# EAGLE design gps_tracker2.0 (EAGLE 9.6.2)
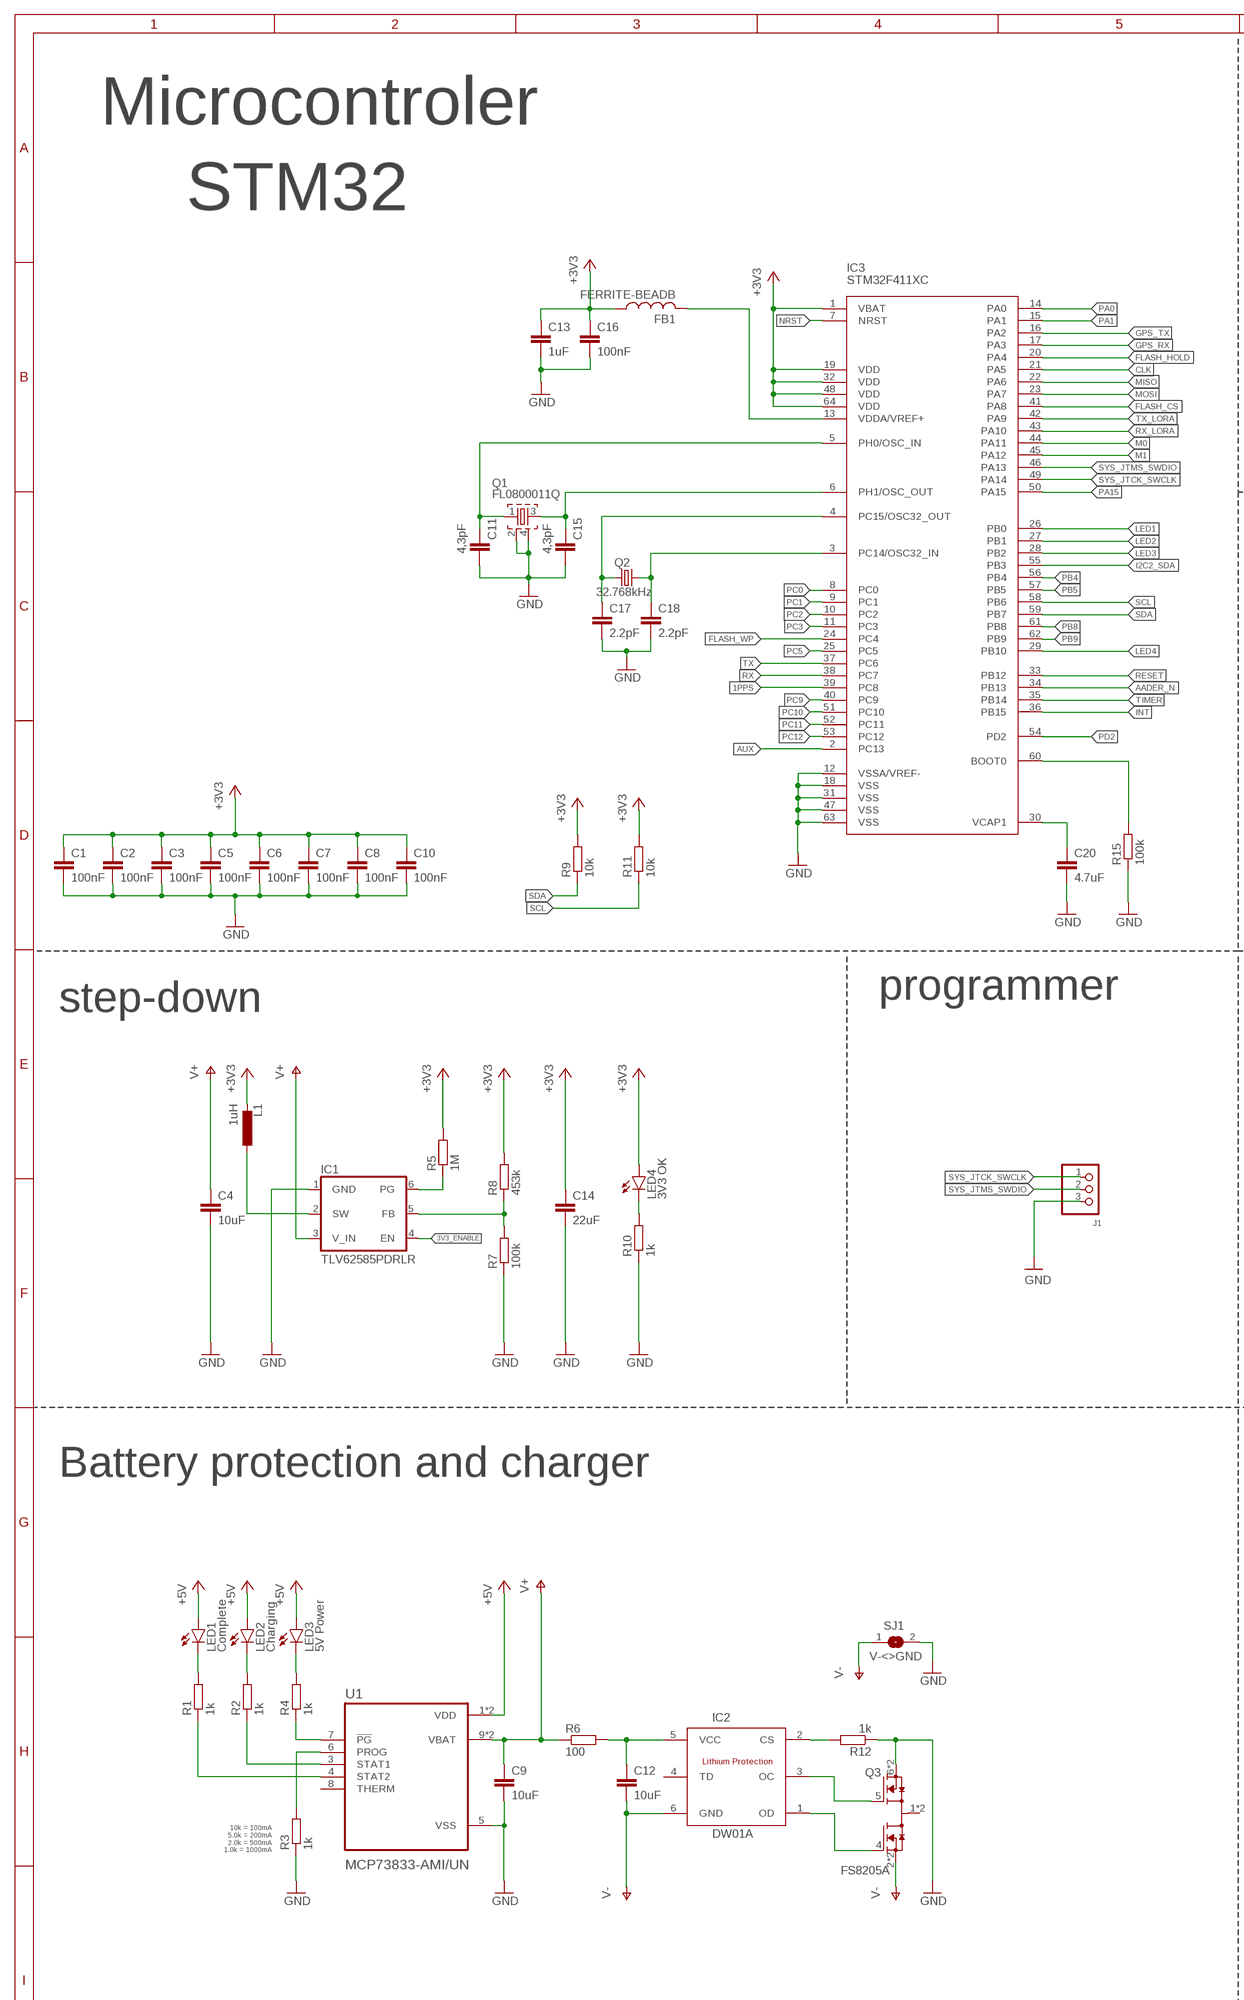
[diagram p0: schematic, sheet 1, part 1 of 2]
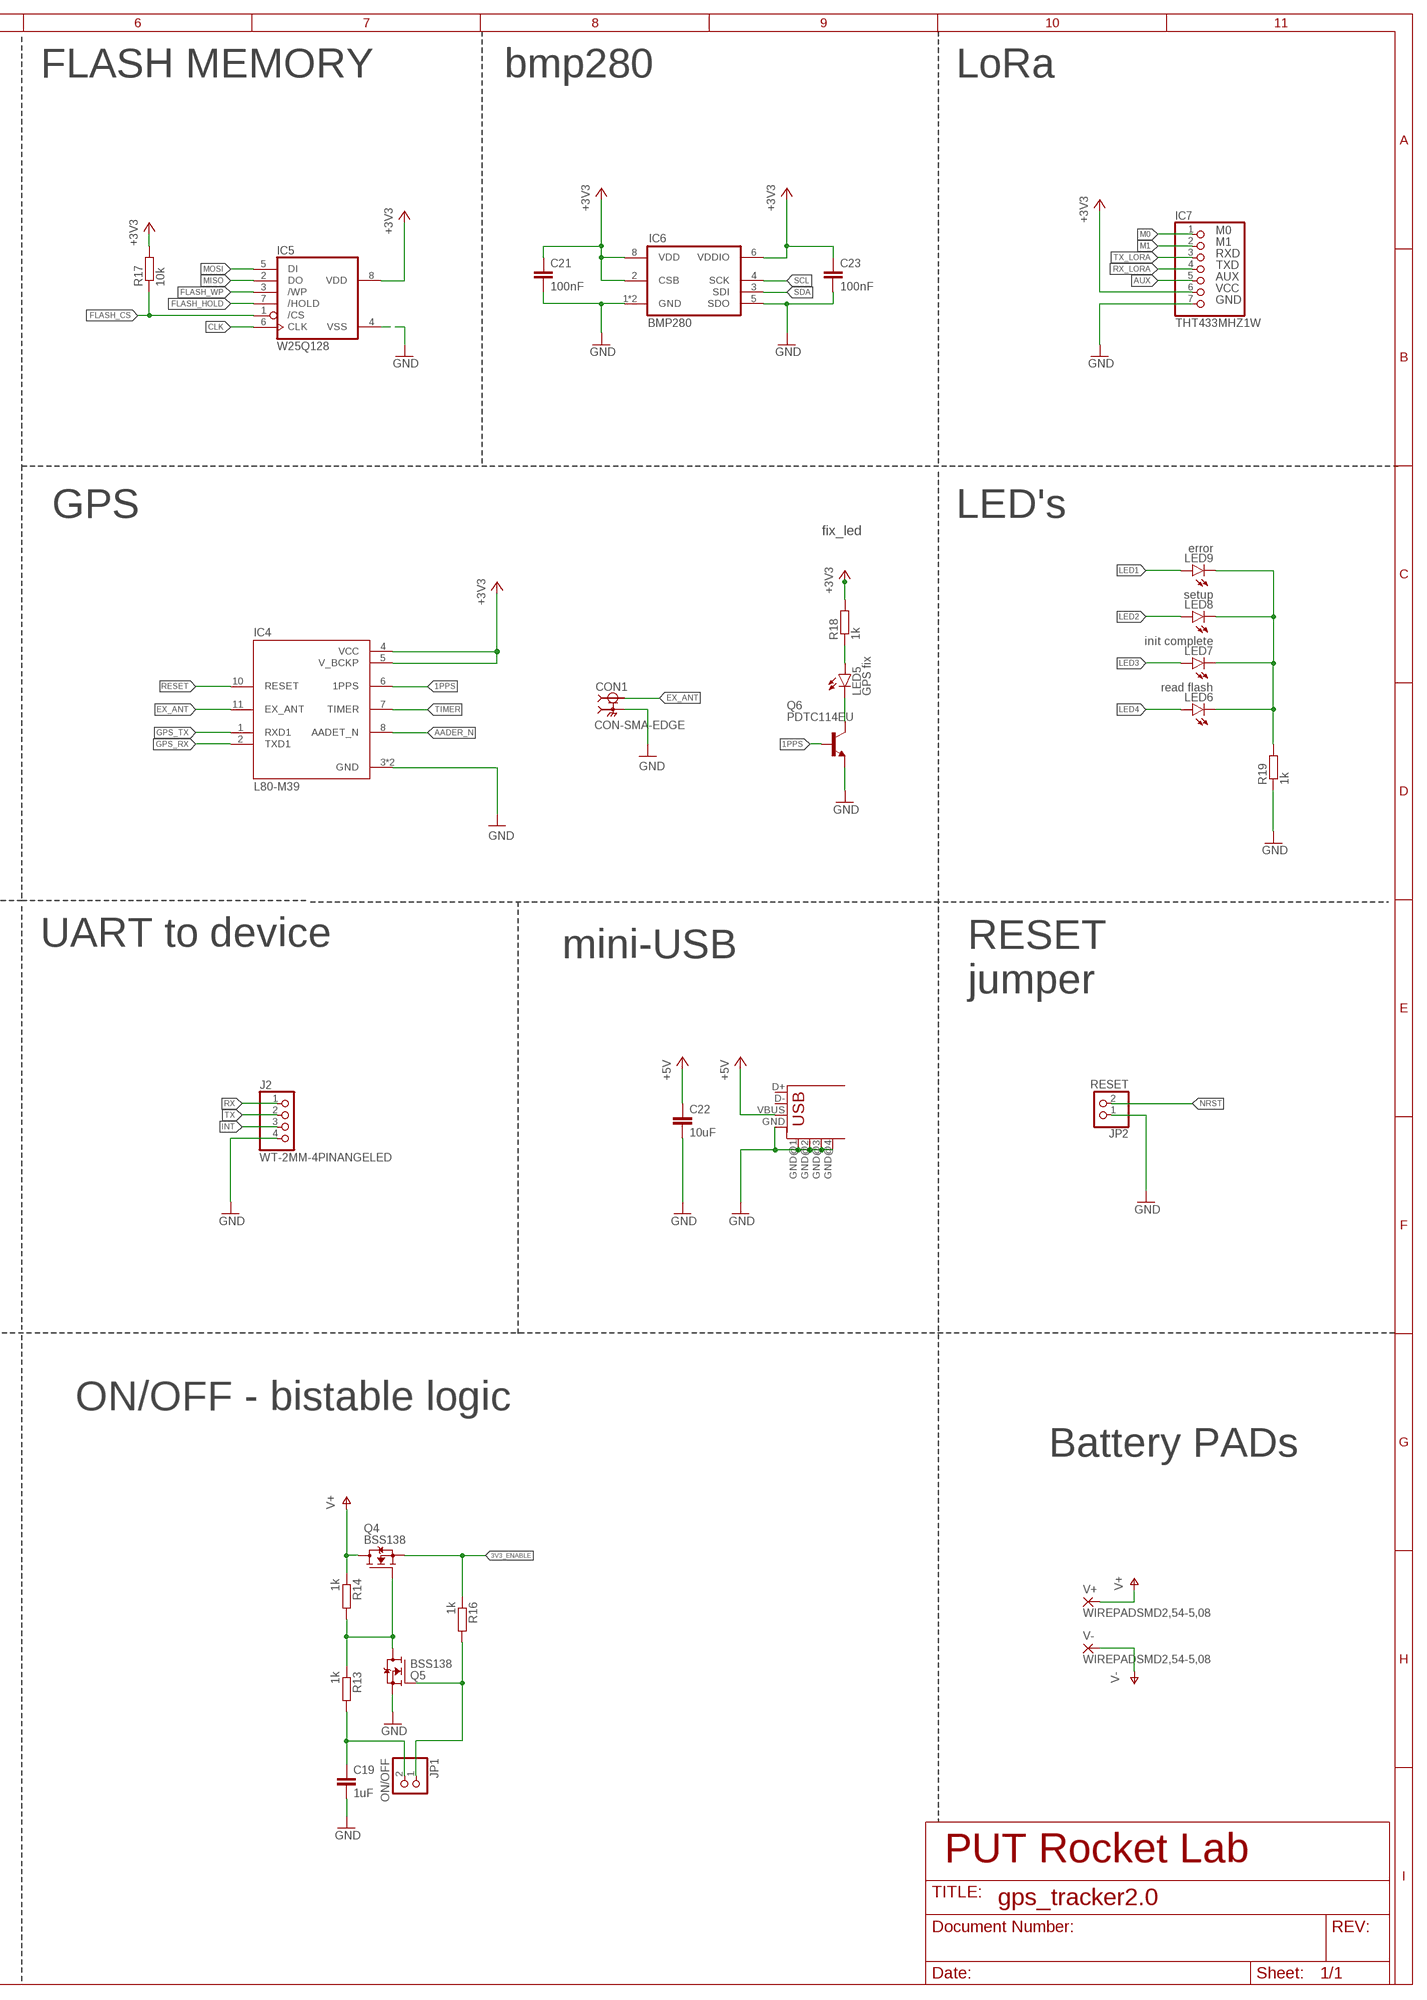
[diagram p1: schematic, sheet 1, part 2 of 2]

## Parts
C1  100nF  C-EUC0805  [C0805]
C2  100nF  C-EUC0805  [C0805]
C3  100nF  C-EUC0805  [C0805]
C4  10uF  C-EUC0805  [C0805]
C5  100nF  C-EUC0805  [C0805]
C6  100nF  C-EUC0805  [C0805]
C7  100nF  C-EUC0805  [C0805]
C8  100nF  C-EUC0805  [C0805]
C9  10uF  C-EUC0805  [C0805]
C10  100nF  C-EUC0805  [C0805]
C11  4,3pF  C-EUC0805  [C0805]
C12  10uF  C-EUC0805  [C0805]
C13  1uF  C-EUC0805  [C0805]
C14  22uF  C-EUC0805  [C0805]
C15  4,3pF  C-EUC0805  [C0805]
C16  100nF  C-EUC0805  [C0805]
C17  2.2pF  C-EUC0805  [C0805]
C18  2.2pF  C-EUC0805  [C0805]
C19  1uF  C-EUC0805  [C0805]
C20  4.7uF  C-EUC0805  [C0805]
C21  100nF  C-EUC0805  [C0805]
C22  10uF  C-EUC0805  [C0805]
C23  100nF  C-EUC0805  [C0805]
CON1  CON-SMA-EDGE  [CINCH_142-0701-801]
CON2  USB-SHIELD  [USB-M-S1]
FB1  FERRITE-BEADB  [0805]
IC1  TLV62585PDRLR  [SOT563]
IC2  DW01A  [SOT23-6]
IC3  STM32F411XC  [LQFP64]
IC4  L80-M39  [XCVR_L80-M39]
IC5  W25Q128  [SO08-FLASH]
IC6  BMP280  [BMP280]
IC7  THT433MHZ1W  [E32M1000]
J1  WT-2MM-3PINANGELED  [W_TYPE_2MM_3_A]
J2  WT-2MM-4PINANGELED  [W_TYPE_2MM_4_A]
JP1  ON/OFF  PINHD-1X2  [1X02]
JP2  RESET  PINHD-1X2  [1X02]
L1  1uH  L-EUL5650M  [L5650M]
LED1  Complete  LEDCHIPLED_0805  [CHIPLED_0805]
LED2  Charging  LEDCHIPLED_0805  [CHIPLED_0805]
LED3  5V Power  LEDCHIPLED_0805  [CHIPLED_0805]
LED4  3V3 OK  LEDCHIPLED_0805  [CHIPLED_0805]
LED5  GPS fix  LEDCHIPLED_0805  [CHIPLED_0805]
LED6  read flash  LEDCHIPLED_0805  [CHIPLED_0805]
LED7  init complete  LEDCHIPLED_0805  [CHIPLED_0805]
LED8  setup  LEDCHIPLED_0805  [CHIPLED_0805]
LED9  error  LEDCHIPLED_0805  [CHIPLED_0805]
Q1  FL0800011Q  [FL0800011Q]
Q2  32.768kHz  FC-135_32.768  [MC-405]
Q3  FS8205A  [SOP65P640X120-8N]
Q4  BSS138  [SOT23]
Q5  BSS138  [SOT23]
Q6  PDTC114EU  BC846ASMD  [SOT23]
R1  1k  R-EU_R0805  [R0805]
R2  1k  R-EU_R0805  [R0805]
R3  1k  R-EU_R0805  [R0805]
R4  1k  R-EU_R0805  [R0805]
R5  1M  R-EU_R0805  [R0805]
R6  100  R-EU_R0805  [R0805]
R7  100k  R-EU_R0805  [R0805]
R8  453k  R-EU_R0805  [R0805]
R9  10k  R-EU_R0805  [R0805]
R10  1k  R-EU_R0805  [R0805]
R11  10k  R-EU_R0805  [R0805]
R12  1k  R-EU_R0805  [R0805]
R13  1k  R-EU_R0805  [R0805]
R14  1k  R-EU_R0805  [R0805]
R15  100k  R-EU_R0805  [R0805]
R16  1k  R-EU_R0805  [R0805]
R17  10k  R-EU_R0805  [R0805]
R18  1k  R-EU_R0805  [R0805]
R19  1k  R-EU_R0805  [R0805]
SJ1  V-<>GND  SJ  [SJ]
U1  MCP73833-AMI/UN  [SOP50P490X110-10N]
V+  WIREPADSMD2,54-5,08  [SMD2,54-5,08]
V-  WIREPADSMD2,54-5,08  [SMD2,54-5,08]

## Nets
1PPS: IC3.39(PC8) IC4.6(1PPS) Q6.1(B)
3V3_ENABLE: IC1.4(EN) Q4.2(S) R16.1
+3V3: C1.1 C2.1 C3.1 C5.1 C6.1 C7.1 C8.1 C10.1 C13.1 C14.1 C16.1 C21.1 C23.1 FB1.1 IC3.1(VBAT) IC3.19(VDD) IC3.32(VDD) IC3.48(VDD) IC3.64(VDD) IC4.4(VCC) IC4.5(V_BCKP) IC5.8(VDD) IC6.2(CSB) IC6.6(VDDIO) IC6.8(VDD) IC7.6(VCC) L1.2 LED4.A R5.2 R8.2 R9.2 R11.2 R17.2 R18.2
+5V: C22.1 CON2.VBUS LED1.A LED2.A LED3.A U1.1(VDD) U1.2(VDD)
AADER_N: IC3.34(PB13) IC4.8(AADET_N)
AUX: IC3.2(PC13) IC7.5(AUX)
CLK: IC3.21(PA5) IC5.6(CLK)
EX_ANT: CON1.1 IC4.11(EX_ANT)
FLASH_CS: IC3.41(PA8) IC5.1(/CS) R17.1
FLASH_HOLD: IC3.20(PA4) IC5.7(/HOLD)
FLASH_WP: IC3.24(PC4) IC5.3(/WP)
GND: C1.2 C2.2 C3.2 C4.2 C5.2 C6.2 C7.2 C8.2 C9.2 C10.2 C11.2 C13.2 C14.2 C15.2 C16.2 C17.2 C18.2 C19.2 C20.2 C21.2 C22.2 C23.2 CON1.S1 CON1.S2 CON1.S3 CON1.S4 CON2.GND CON2.GND@1(GND) CON2.GND@2(GND) CON2.GND@3(GND) CON2.GND@4(GND) IC1.1(GND) IC3.12(VSSA/VREF-) IC3.18(VSS) IC3.31(VSS) IC3.47(VSS) IC3.63(VSS) IC4.3(GND) IC4.12(GND) IC5.4(VSS) IC6.1(GND) IC6.5(SDO) IC6.7(GND) IC7.7(GND) J1.3 J2.4 JP2.1 Q1.2 Q1.4 Q3.6(S2) Q3.7(S2) Q5.2(S) Q6.2(E) R3.1 R7.1 R10.1 R12.1 R15.1 R19.1 SJ1.2 U1.5(VSS)
GPS_RX: IC3.17(PA3) IC4.2(TXD1)
GPS_TX: IC3.16(PA2) IC4.1(RXD1)
I2C2_SDA: IC3.55(PB3)
INT: IC3.36(PB15) J2.3
LED1: IC3.26(PB0) LED9.A
LED2: IC3.27(PB1) LED8.A
LED3: IC3.28(PB2) LED7.A
LED4: IC3.29(PB10) LED6.A
M0: IC3.44(PA11) IC7.1(M0)
M1: IC3.45(PA12) IC7.2(M1)
MISO: IC3.22(PA6) IC5.2(DO)
MOSI: IC3.23(PA7) IC5.5(DI)
N$1: LED6.C LED7.C LED8.C LED9.C R19.2
N$2: LED3.C R4.2
N$3: R4.1 U1.7(!PG)
N$4: R2.1 U1.3(STAT1)
N$5: LED2.C R2.2
N$6: R1.1 U1.4(STAT2)
N$7: LED1.C R1.2
N$8: R3.2 U1.6(PROG)
N$9: C12.1 IC2.5(VCC) R6.2
N$10: IC2.3(OC) Q3.5(G2)
N$11: IC2.1(OD) Q3.4(G1)
N$12: IC2.2(CS) R12.2
N$13: Q4.1(G) Q5.3(D) R13.1 R14.2
N$14: C19.1 JP1.2 R13.2
N$16: JP1.1 Q5.1(G) R16.2
N$21: LED4.C R10.2
N$24: IC1.5(FB) R7.2 R8.1
N$25: IC1.6(PG) R5.1
N$26: IC1.2(SW) L1.1
N$33: C20.1 IC3.30(VCAP1)
N$34: C18.1 IC3.3(PC14/OSC32_IN) Q2.2
N$35: C17.1 IC3.4(PC15/OSC32_OUT) Q2.1
N$36: C15.1 IC3.6(PH1/OSC_OUT) Q1.3
N$38: IC3.60(BOOT0) R15.2
N$39: FB1.2 IC3.13(VDDA/VREF+)
N$46: C11.1 IC3.5(PH0/OSC_IN) Q1.1
N$49: LED5.C Q6.3(C)
N$50: LED5.A R18.1
NRST: IC3.7(NRST) JP2.2
PA0: IC3.14(PA0)
PA1: IC3.15(PA1)
PA15: IC3.50(PA15)
PB4: IC3.56(PB4)
PB5: IC3.57(PB5)
PB8: IC3.61(PB8)
PB9: IC3.62(PB9)
PC0: IC3.8(PC0)
PC1: IC3.9(PC1)
PC2: IC3.10(PC2)
PC3: IC3.11(PC3)
PC5: IC3.25(PC5)
PC9: IC3.40(PC9)
PC10: IC3.51(PC10)
PC11: IC3.52(PC11)
PC12: IC3.53(PC12)
PD2: IC3.54(PD2)
RESET: IC3.33(PB12) IC4.10(RESET)
RX: IC3.38(PC7) J2.1
RX_LORA: IC3.43(PA10) IC7.4(TXD)
SCL: IC3.58(PB6) IC6.4(SCK) R11.1
SDA: IC3.59(PB7) IC6.3(SDI) R9.1
SYS_JTCK_SWCLK: IC3.49(PA14) J1.1
SYS_JTMS_SWDIO: IC3.46(PA13) J1.2
TIMER: IC3.35(PB14) IC4.7(TIMER)
TX: IC3.37(PC6) J2.2
TX_LORA: IC3.42(PA9) IC7.3(RXD)
V+: C4.1 C9.1 IC1.3(V_IN) Q4.3(D) R6.1 R14.1 U1.9(VBAT) U1.10(VBAT) V+.1(P)
V-: C12.2 IC2.6(GND) Q3.2(S1) Q3.3(S1) SJ1.1 V-.1(P)
Unconnected: CON2.D+ CON2.D- IC2.4(TD) Q3.1(D12) Q3.8(D12) U1.8(THERM)

## Notes on the sheet
- FLASH MEMORY | bmp280 | LoRa
- Microcontroler
- STM32
- GPS | LED's
- fix_led
- step-down | programmer | UART to device | mini-USB
- RESET 
  jumper
- Battery protection and charger | ON/OFF - bistable logic
- Battery PADs
- 10k = 100mA
  5.0k = 200mA
  2.0k = 500mA
  1.0k = 1000mA
- PUT Rocket Lab

## Library data of the parts
C1-C23 = PUTRocketLab_RCL:C-EU: CAPACITOR, European symbol; SPICEPREFIX: C
CON1 = PUTRocketLab_connectors:CON-SMA-EDGE: Conn SMA RCP 0Hz to 18GHz 50Ohm Solder ST Edge Mount Gold Check prices <https://snapeda.com/parts/142-0701-801/Cinch%20Connectivity/view-part/?ref=eda>; AVAILABILITY: Warning; DESCRIPTION: SMA Connector Jack, Female Socket 50Ohm Board Edge, End Launch Solder; DIGIKEY-PURCHASE-URL: https://snapeda.com/shop?store=DigiKey&id=2691213; MF: Cinch Connectivity; MOUSER-PURCHASE-URL: https://snapeda.com/shop?store=Mouser&id=2691213; MP: 142-0701-801; PACKAGE: None; PRICE: None
CON2 = PUTRocketLab_connectors:USB-SHIELD
FB1 = PUTRocketLab_RCL:FERRITE-BEAD: Ferrite beads in various packages
IC1 = PUTRocketLab_IC:TLV62585PDRLR
IC2 = PUTRocketLab_IC:DW01A; AVAILABILITY: Unavailable; DESCRIPTION: One Cell Lithium-ion/Polymer Battery Protection IC; MF: Fortune Semiconductor; MP: DW01A; PACKAGE: SOT-23-6 Fortune Semiconductor; PRICE: None
IC3 = PUTRocketLab_IC:STM32F411XC
IC4 = PUTRocketLab_modules:L80-M39: Check prices <https://pricing.snapeda.com/search/part/L80-M39/?ref=eda>; AVAILABILITY: Bad; DESCRIPTION: L80 is an ultra compact GPS POT (Patch on Top) module with an embedded 15.0mm × 15.0mm × 4.0mm patch antenna.; MF: Quectel; MP: L80-M39; PACKAGE: None; PRICE: None
IC5 = PUTRocketLab_IC:W25Q128
IC6 = PUTRocketLab_modules:BMP280: The BMP280 is an absolute barometric pressure sensor especially designed for mobile applications. The sensor module is housed in an extremely compact 8-pin metal-lid LGA package with a footprint of only 2.0 × 2.5 mm2 and 0.95 mm package height. Its small dimensions and its low power consumption of 2.7 μA @1Hz allow the implementation in battery driven devices such as mobile phones, GPS modules or watches. The library has been designed by Richard Magdycz <https://www.facebook.com/groups/eaglecadsoftUK>
IC7 = PUTRocketLab_modules:THT433MHZ1W
J1 = PUTRocketLab_connectors:WT-2MM-3PIN
J2 = PUTRocketLab_connectors:WT-2MM-4PIN
JP1 JP2 = PUTRocketLab_connectors:PINHD-1X2: PIN HEADER
L1 = PUTRocketLab_RCL:L-EU: INDUCTOR, European symbol; SPICEPREFIX: L
LED1-LED9 = PUTRocketLab_semiconductors:LED: LED OSRAM: - CHIPLED LG R971, LG N971, LY N971, LG Q971, LY Q971, LO R971, LY R971 LH N974, LH R974 LS Q976, LO Q976, LY Q976 LO Q996 - Hyper CHIPLED LW Q18S LB Q993, LB Q99A, LB R99A - SideLED LS A670, LO A670, LY A670, LG A670, LP A670 LB A673, LV A673, LT A673, LW A673 LH A674 LY A675 LS A676, LA A676, LO A676, LY A676, LW A676 LS A679, LY A679, LG A679 - Hyper Micro SIDELED® LS Y876, LA Y876, LO Y876, LY Y876 LT Y87S - SmartLED LW L88C, LW L88S LB L89C, LB L89S, LG L890 LS L89K, LO L89K, LY L89K LS L896, LA L896, LO L896, LY L896 - TOPLED LS T670, LO T670, LY T670, LG T670, LP T670 LSG T670, LSP T670, LSY T670, LOP T670, LYG T670 LG T671, LOG T671, LSG T671 LB T673, LV T673, LT T673, LW T673 LH T674 LS T676, LA T676, LO T676, LY T676, LB T676, LH T676, LSB T676, LW T676 LB T67C, LV T67C, LT T67C, LS T67K, LO T67K, LY T67K, LW E67C LS E67B, LA E67B, LO E67B, LY E67B, LB E67C, LV E67C, LT E67C LW T67C LS T679, LY T679, LG T679 LS T770, LO T770, LY T770, LG T770, LP T770 LB T773, LV T773, LT T773, LW T773 LH T774 LS E675, LA E675, LY E675, LS T675 LS T776, LA T776, LO T776, LY T776, LB T776 LHGB T686 LT T68C, LB T68C - Hyper Mini TOPLED® LB M676 - Mini TOPLED Santana® LG M470 LS M47K, LO M47K, LY M47K Source: http://www.osram.convergy.de LUXEON: - LUMILED® LXK2-PW12-R00, LXK2-PW12-S00, LXK2-PW14-U00, LXK2-PW14-V00 LXK2-PM12-R00, LXK2-PM12-S00, LXK2-PM14-U00 LXK2-PE12-Q00, LXK2-PE12-R00, LXK2-PE12-S00, LXK2-PE14-T00, LXK2-PE14-U00 LXK2-PB12-K00, LXK2-PB12-L00, LXK2-PB12-M00, LXK2-PB14-N00, LXK2-PB14-P00, LXK2-PB14-Q00 LXK2-PR12-L00, LXK2-PR12-M00, LXK2-PR14-Q00, LXK2-PR14-R00 LXK2-PD12-Q00, LXK2-PD12-R00, LXK2-PD12-S00 LXK2-PH12-R00, LXK2-PH12-S00 LXK2-PL12-P00, LXK2-PL12-Q00, LXK2-PL12-R00 Source: www.luxeon.com KINGBRIGHT: KA-3528ASYC Source: www.kingbright.com
Q1 = PUTRocketLab_cristals:FL0800011Q: kHz RANGE CRYSTAL UNIT SMD Source: MC-306_405_406_E07X.PDF Homepage <http://www.epsontoyocom.co.jp>
Q2 = PUTRocketLab_cristals:FC-135_32.768: kHz RANGE CRYSTAL UNIT SMD Source: MC-306_405_406_E07X.PDF Homepage <http://www.epsontoyocom.co.jp>; OC_FARNELL: unknown; OC_NEWARK: unknown
Q3 = PUTRocketLab_IC:FS8205A: N/A; AVAILABILITY: Unavailable; MF: Fortune Semiconductor; MP: FS8205A; PACKAGE: Package; PRICE: None
Q4 Q5 = PUTRocketLab_semiconductors:BSS138: BSS138 N-Channel Logic Level Enhancement Mode Field Effect Transistor Source: http://www.fairchildsemi.com/datasheets/BS/BSS138.pdf; MF: Fairchild; MPN: BSS138; OC_FARNELL: 9845330; OC_NEWARK: 67R2009
Q6 = PUTRocketLab_semiconductors:BC846*: NPN Transistor
R1-R19 = PUTRocketLab_RCL:R-EU_: RESISTOR, European symbol; SPICEPREFIX: R
SJ1 = PUTRocketLab_misc:SJ: SMD solder JUMPER
U1 = PUTRocketLab_IC:MCP73833-AMI/UN: Check prices <https://snapeda.com/parts/MCP73833-AMI/UN/Microchip/view-part/?ref=eda>; ARROW_ELECTRONICS-PURCHASE-URL: https://snapeda.com/shop?store=Arrow+Electronics&id=142622; AVAILABILITY: Good; DESCRIPTION: Charger IC Lithium Ion/Polymer 10-MSOP; DIGIKEY-PURCHASE-URL: https://snapeda.com/shop?store=DigiKey&id=142622; MF: Microchip; MOUSER-PURCHASE-URL: https://snapeda.com/shop?store=Mouser&id=142622; MP: MCP73833-AMI/UN; PACKAGE: MSOP-10 Microchip; PRICE: None
V+ V- = PUTRocketLab_misc:WIREPAD: Wire PAD connect wire on PCB

## Board
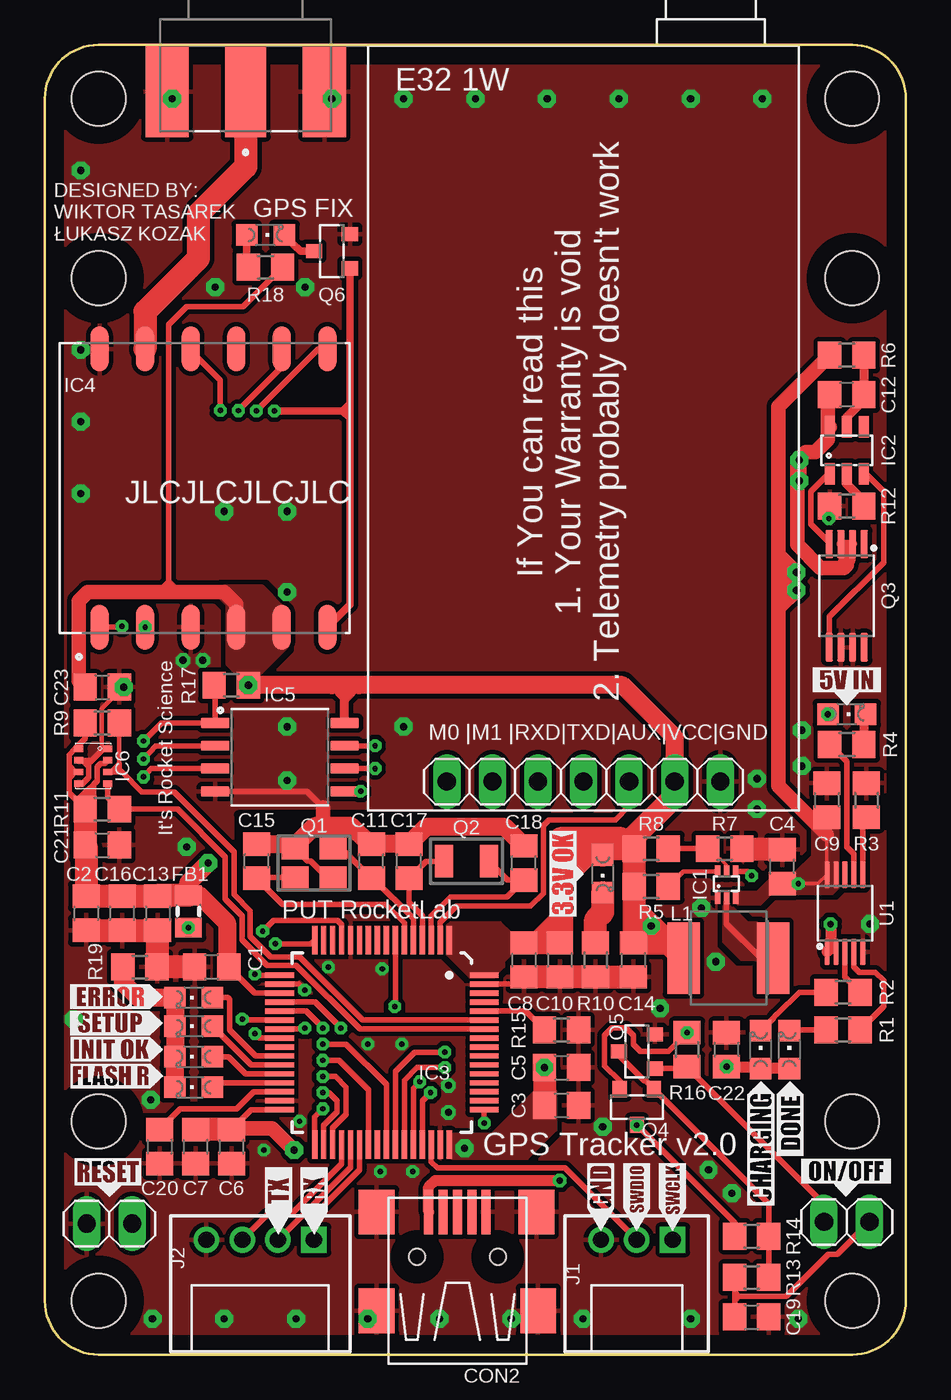
[diagram p2: board, top side]
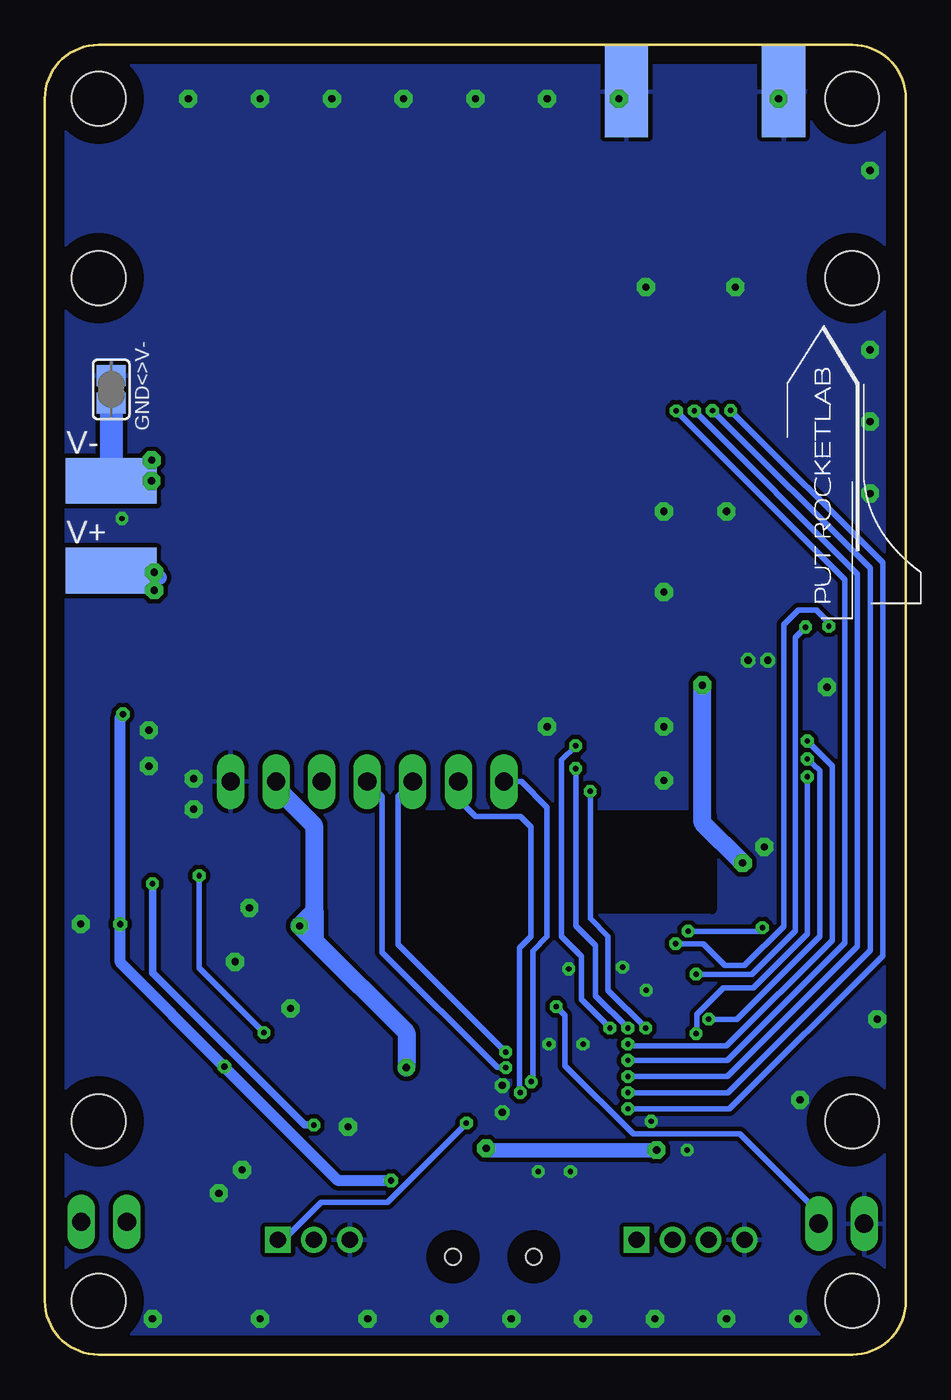
[diagram p3: board, bottom side, seen from below]

Size 48 x 73 mm. Coordinates in mm from the lower left corner, seen from the top.
Outline: 45,0 3,0 arc-90 0,3 0,70 arc-90 3,73 45,73 arc-90 48,70 48,3 arc-90 45,0
Copper layers (1*16): Top 0.035mm / dielectric 1.5mm / Bottom 0.035mm
Design rules "default *": minimum track width 6mil, minimum drill 0.3mm, track to track 6mil, track to pad 6mil, pad to pad 6mil, via to via 6mil, smd to smd 6mil, copper to edge 40mil, drill to drill 6mil, minimum pad ring 10mil, minimum via ring 8mil, stop-mask expansion 4mil, vias tented up to drill 20mil, thermal gap 10mil
Holes 3 mm at 3,13 3,3 3,70 45,70 45,3 45,13 3,60 45,60
tRestrict: area 10.8,24.8 to 28,30.1
bRestrict: area 10.8,24.8 to 28,30.1

### Footprints (pad centres in the part's own frame; a part is rotated, then mirrored left to right if it is on the bottom)
C0805 = smd 1.3 x 1.5: 1 -0.95,0; 2 0.95,0
CINCH_142-0701-801 = smd 2.286 x 5.08: 1 0,0 | smd 2.413 x 5.08: S1 -4.381,0; S2 4.381,0 | smd 2.413 x 5.08 bottom: S3 -4.381,0; S4 4.381,0
USB-M-S1 = smd 2.5 x 0.5: D+ 2.75,0; D- 2.75,0.8; GND 2.75,-1.6; ID 2.75,-0.8; VBUS 2.75,1.6 | smd 2.5 x 2: GND@1 -2.75,-4.5; GND@2 -2.75,4.5; GND@3 2.75,-4.4; GND@4 2.75,4.5 | hole 0.9: 0.25,2.25; 0.25,-2.25
0805 = smd 1.1 x 1.5: 1 -0.9,0; 2 0.9,0
SOT563 = smd 0.3 x 0.67: 1 -0.5,-0.74; 2 0,-0.74; 3 0.5,-0.74; 4 0.5,0.74; 5 0,0.74; 6 -0.5,0.74
SOT23-6 = smd 0.55 x 1.2: 1 -0.95,-1.3; 2 0,-1.3; 3 0.95,-1.3; 4 0.95,1.3; 5 0,1.3; 6 -0.95,1.3
LQFP64 = smd 0.3 x 1.6: 1 -3.75,-5.7; 2 -3.25,-5.7; 3 -2.75,-5.7; 4 -2.25,-5.7; 5 -1.75,-5.7; 6 -1.25,-5.7; 7 -0.75,-5.7; 8 -0.25,-5.7; 9 0.25,-5.7; 10 0.75,-5.7; 11 1.25,-5.7; 12 1.75,-5.7; 13 2.25,-5.7; 14 2.75,-5.7; 15 3.25,-5.7; 16 3.75,-5.7; 33 3.75,5.7; 34 3.25,5.7; 35 2.75,5.7; 36 2.25,5.7; 37 1.75,5.7; 38 1.25,5.7; 39 0.75,5.7; 40 0.25,5.7; 41 -0.25,5.7; 42 -0.75,5.7; 43 -1.25,5.7; 44 -1.75,5.7; 45 -2.25,5.7; 46 -2.75,5.7; 47 -3.25,5.7; 48 -3.75,5.7 | smd 1.6 x 0.3: 17 5.7,-3.75; 18 5.7,-3.25; 19 5.7,-2.75; 20 5.7,-2.25; 21 5.7,-1.75; 22 5.7,-1.25; 23 5.7,-0.75; 24 5.7,-0.25; 25 5.7,0.25; 26 5.7,0.75; 27 5.7,1.25; 28 5.7,1.75; 29 5.7,2.25; 30 5.7,2.75; 31 5.7,3.25; 32 5.7,3.75; 49 -5.7,3.75; 50 -5.7,3.25; 51 -5.7,2.75; 52 -5.7,2.25; 53 -5.7,1.75; 54 -5.7,1.25; 55 -5.7,0.75; 56 -5.7,0.25; 57 -5.7,-0.25; 58 -5.7,-0.75; 59 -5.7,-1.25; 60 -5.7,-1.75; 61 -5.7,-2.25; 62 -5.7,-2.75; 63 -5.7,-3.25; 64 -5.7,-3.75
XCVR_L80-M39 = smd 2.5 x 1: 1 -7.75,6.35; 2 -7.75,3.81; 3 -7.75,1.27; 4 -7.75,-1.27; 5 -7.75,-3.81; 6 -7.75,-6.35; 7 7.75,-6.35; 8 7.75,-3.81; 9 7.75,-1.27; 10 7.75,1.27; 11 7.75,3.81; 12 7.75,6.35
SO08-FLASH = smd 0.58 x 1.61: 1 -1.905,-3.605; 2 -0.635,-3.605; 3 0.635,-3.605; 4 1.905,-3.605; 5 1.905,3.605; 6 0.635,3.605; 7 -0.635,3.605; 8 -1.905,3.605
BMP280 = smd 0.35 x 0.5: 1 0.975,-0.8; 2 0.325,-0.8; 3 -0.325,-0.8; 4 -0.975,-0.8; 5 -0.975,0.8; 6 -0.325,0.8; 7 0.325,0.8; 8 0.975,0.8
E32M1000 = drill 1.016 long: 1 -7.62,0; 2 -5.08,0; 3 -2.54,0; 4 0,0; 5 2.54,0; 6 5.08,0; 7 7.62,0
W_TYPE_2MM_3_A = drill 0.914 square: 1 -2,0 | drill 0.914: 2 0,0; 3 2,0
W_TYPE_2MM_4_A = drill 0.914 square: 1 -3,0 | drill 0.914: 2 -1,0; 3 1,0; 4 3,0
1X02 = drill 1.016 long: 1 -1.27,0; 2 1.27,0
L5650M = smd 1.8 x 4: 1 -2.5,0; 2 2.5,0
CHIPLED_0805 = smd 1.2 x 1.2: A 0,-1.05; C 0,1.05
FL0800011Q = smd 1.5 x 1.2: 1 -1.06,-0.8; 2 1.06,-0.8; 3 1.06,0.8; 4 -1.06,0.8
MC-405 = smd 1 x 1.8: 1 -1.25,0; 2 1.25,0
SOP65P640X120-8N = smd 1.56 x 0.4: 1 -2.88,0.975; 2 -2.88,0.325; 3 -2.88,-0.325; 4 -2.88,-0.975; 5 2.88,-0.975; 6 2.88,-0.325; 7 2.88,0.325; 8 2.88,0.975
SOT23 = smd 0.8 x 0.9: 1 -0.95,-1; 2 0.95,-1; 3 0,1
R0805 = smd 1.3 x 1.5: 1 -0.95,0; 2 0.95,0
SJ = smd 1.168 x 1.6: 1 -0.762,0; 2 0.762,0
SOP50P490X110-10N = smd 1.47 x 0.28: 1 -2.15,1; 2 -2.15,0.5; 3 -2.15,0; 4 -2.15,-0.5; 5 -2.15,-1; 6 2.15,-1; 7 2.15,-0.5; 8 2.15,0; 9 2.15,0.5; 10 2.15,1
SMD2,54-5,08 = smd 2.54 x 5.08: 1 0,0

### Placement (x,y rotation side)
C1  9.3,21.6 180 top
C2  2.3,24.6 270 top
C3  28.8,13.9 0 top
C4  41.1,27.2 90 top
C5  28.8,16 0 top
C6  10.4,11.6 270 top
C7  8.4,11.6 270 top
C8  26.7,22 270 top
C9  43.6,30.9 90 top
C10  28.7,22 270 top
C11  18.2,27.5 90 top
C12  44.7,53.5 180 top
C13  6.3,24.6 270 top
C14  32.8,22 270 top
C15  11.8,27.5 90 top
C16  4.3,24.6 270 top
C17  20.3,27.5 90 top
C18  26.7,27.4 90 top
C19  39.4,2.1 0 top
C20  6.4,11.6 270 top
C21  3.2,28.4 0 top
C22  38,17 90 top
C23  3.2,37.2 0 top
CON1  11.2,70.4 0 top
CON2  23,5.2 90 top
FB1  8,24.7 270 top
IC1  38,26.2 0 top
IC2  44.7,50.4 0 top
IC3  18.79,17.4 180 top
IC4  9.4,48.3 90 top
IC5  13.1,33.3 270 top
IC6  2.7,32.8 90 top
IC7  30.03,31.94 0 top
J1  33,6.4 180 top
J2  12,6.4 180 top
JP1  44.7,7.4 0 top
JP2  3.6,7.3 0 top
L1  38.1,22.1 180 top
LED1  41.5,17 0 top
LED2  39.9,17 0 top
LED3  44.7,35.7 270 top
LED4  31.1,26.8 180 top
LED5  12.3,62.4 270 top
LED6  8.3,14.9 90 top
LED7  8.3,16.6 90 top
LED8  8.3,18.3 90 top
LED9  8.3,19.9 90 top
Q1  15,27.4 180 top
Q2  23.5,27.5 0 top
Q3  44.7,42.3 270 top
Q4  33,13.8 180 top
Q5  33,16.9 90 top
Q6  16,61.5 90 top
R1  44.5,18.1 180 top
R2  44.5,20.2 180 top
R3  45.8,30.9 270 top
R4  44.7,34 0 top
R5  33.8,26.1 180 top
R6  44.7,55.7 0 top
R7  37.9,28.2 180 top
R8  33.8,28.2 180 top
R9  3.2,35.2 180 top
R10  30.7,22 90 top
R11  3.2,30.4 180 top
R12  44.7,47.3 0 top
R13  39.4,4.3 180 top
R14  39.4,6.6 0 top
R15  28.8,18.1 180 top
R16  35.8,17 270 top
R17  10.39,37.31 0 top
R18  12.3,60.6 0 top
R19  5.3,21.6 180 top
SJ1  44.3,53.8 90 bottom
U1  44.6,24.6 90 top
V+  44.3,43.7 270 bottom
V-  44.3,48.7 270 bottom

### Tracks (layer width: path | path; a pad name or v marks a point on that pad's centre or on a via)
1PPS  (via drill 0.3)
  Top 0.305: v15.5,16.4 16.4,16.4 18.04,14.76 IC3.39
  Top 0.406: IC4.6 17,41.8 17,52 17,52.2 | Q6.1 17,53 | 17,53 17,52.2 | v12.8,52.6 16.6,52.6 | 16.6,52.6 17,53 | 16.6,52.6 17,52.2
  Bottom 0.305: v12.8,52.6 3.4,43.2 3.4,22.95 9.95,16.4 v15.5,16.4
3V3_ENABLE  (via drill 0.3)
  Top 0.305: Q4.2 32.05,15.25 31.2,16.1 31.2,17.8 31.6,18.2 32.4,18.2 32.8,17.8 32.8,17.3 33.2,16.9 34.75,16.9 R16.1 | v39.4,26.7 39.16,26.94 IC1.4
  Bottom 0.305: v39.4,26.7 39.4,21.55 R16.1
  other vias: 35.8,17.95
+3V3  (via drill 0.4 pad 0.95, 0.4 pad 1)
  Top 0.305: IC3.32 11.5,13.65 10.47,12.62 C6.1 | C1.1 11.7,20.15 IC3.19 | IC6.2 3.33,32.95 3.12,32.95 2.91,32.74 2.91,31.98 2.72,31.78 | 1.34,32.82 1.34,33.43 1.69,33.77 | 1.34,32.82 1.72,32.45 1.87,32.45 IC6.6 1.69,32.48 1.34,32.13 | 1.69,33.77 IC6.8 1.9,33.98 | 1.34,32.13 1.34,31.3 1.77,30.88 | 1.34,32.82 1.34,32.13 | 1.69,33.77 1.9,33.98 | 1.9,33.98 2.25,34.33 R9.2 | 1.77,30.88 R11.2 | R11.2 2.42,30.23 2.42,31.49 | 2.72,31.78 2.42,31.49 | R11.2 2.72,30.87 2.72,31.78 | 2.42,31.49 1.81,30.88 1.77,30.88 | R18.2 11.05,58.4 7.9,58.4 6.9,57.4 6.9,43.1 | 7.5,42.5 6.9,43.1 | 6.9,43.1 6.3,42.5 | 8.12,42.5 6.9,42.5 6.9,43.1
  Top 0.508: 17.5,37.31 16.7,36.52 IC5.8 16.7,36.6 16,37.31
  Top 0.813: 28.8,24.6 27.15,22.95 C8.1 | v13.9,11.4 12.68,12.62 12.1,12.62 10.47,12.62 | C23.1 1.9,37.55 1.9,42 2.4,42.5 6.3,42.5 6.9,42.5 7.5,42.5 8.12,42.5 10,42.5 10.67,41.83 IC4.4
  Top 1.016: 28.7,28.9 29.4,28.2 R8.2 32.15,28.9 28.7,28.9 | 28.7,26.4 28.7,28.9 | R17.2 16,37.31 17.5,37.31 32.19,37.31 35.11,34.39 IC7.6 | C1.1 10.15,21.7 10.15,24.06 8.57,25.64 8.04,25.64 | 32.85,23.9 v33.8,23.9 32.95,23.9 32.85,23.8 | FB1.1 8,26.3 v9.1,27.4
  Top 1.27: R8.2 R5.2 32.85,24.85 | 32.85,24.85 32.85,23.9 32.85,23.8 32.85,23 C14.1 34.75,22.95 L1.2 v33.8,23.9 32.85,24.85 | R8.2 31.45,28.2 LED4.A 30.15,27.85 28.8,26.5 28.8,24.6 28.8,23.05 C10.1 C8.1 | R11.2 C21.1 2.3,28.35 C2.1 C16.1 C13.1 6.35,25.6 FB1.1 8.04,25.64 | C5.1 C3.1 | C6.1 C7.1 | R8.2 32.85,28.85 35.11,31.11 IC7.6
  Bottom 0.813: v23.4,11.5 23.3,11.4 v13.9,11.4
  Bottom 1.016: 32.95,23.05 v33.8,23.9 33,24.7 | 32.95,23.05 27.85,17.95 C5.1 | v9.1,27.4 11.34,29.64 R17.2 | IC7.6 35.11,31.61 33,29.5 33,24.7 | 33,24.7 32.95,24.65 32.95,23.05
  other vias: 27.85,16 11.34,37.31
  pour Top (no thermals): 22.4,23.9 22.4,22.3 23.7,21 25,21 25.6,21.6 25.6,21.9 26,22.3 26,23.5 25.4,24.1 22.6,24.1
  pour Top (no thermals): 27.3,14.7 24.9,12.3 22.6,12.3 22.6,11 22.7,10.9 26.9,10.9 28.5,12.5 28.5,14.7
  pour Top (no thermals): 10.7,38 10.2,38.5 10.2,41.6 10.2,41.8 9.8,42.2 9.8,42.6 10,42.8 12.1,42.8 13.2,41.7 13.5,41.4 13.5,39.5 12.8,38.8 12,38
+5V  (via drill 0.35)
  Top 0.152: U1.2 U1.1
  Top 0.61: v28.7,9.7 21.75,9.7 21.4,9.35 CON2.VBUS | C22.1 39.8,16.05 LED2.A LED1.A | v43.8,24 43.8,22.65 U1.1
  Bottom 0.61: v28.7,9.7 31.65,9.7 C22.1 43.8,21.85 v43.8,24 43.8,35.55 LED3.A
  other vias: 38,16.05 43.65,35.7
AADER_N  (via drill 0.3)
  Top 0.305: IC3.34 15.54,12.79 16.28,13.52 16.28,14.15 15.83,14.6 v15.5,14.6 | v10.79,52.62 13.21,55.04 IC4.8
  Bottom 0.305: v10.79,52.62 2,43.83 2,22.54 9.94,14.6 v15.5,14.6
AUX
  Top 0.305: IC3.2 22.04,24.08 22.96,25 27.08,25 27.8,25.72 27.8,29.5 28.1,29.8 31.8,29.8 32.57,30.57 IC7.5
CLK  (via drill 0.3)
  Top 0.305: v15.5,18.2 14.55,19.15 IC3.21 | v18.41,32.66 IC5.6
  Bottom 0.305: v15.5,18.2 17.3,20 17.3,22.8 18.4,23.9 v18.4,32.66 v18.41,32.66
EX_ANT
  Top 1.27: CON1.1 11.2,66.2 8.55,63.55 8.55,61.09 5.59,58.13 IC4.11
FLASH_CS  (via drill 0.3)
  Top 0.305: R17.1 9.49,37.26 IC5.1 6.5,35.2 v5.5,34.2 | v15.5,17.3 16.8,17.3 19.04,15.06 IC3.41
  Bottom 0.305: v5.5,34.2 4.1,32.8 4.1,23.1 10,17.2 15.4,17.2 v15.5,17.3
FLASH_HOLD  (via drill 0.3)
  Top 0.305: IC3.20 15.05,19.65 v16.5,18.2 | v18.41,33.94 IC5.7
  Bottom 0.305: v16.5,18.2 18.1,19.8 18.1,22.2 19.2,23.3 19.2,33.14 v18.41,33.94
FLASH_WP  (via drill 0.3)
  Top 0.305: v11.7,17.9 11.95,17.65 IC3.24 | v5.5,32.2 5.93,32.66 IC5.3
  Bottom 0.305: v11.7,17.9 11.66,17.94 11.66,18.97 10.19,20.44 8.51,20.44 5.5,23.45 v5.5,32.2
GND  (via drill 0.3, 0.3 pad 0.6, 0.4, 0.4 pad 1)
  Top 0.152: CON1.S4 15.6,70.4 v16,70 | IC6.1 3.27,33.77
  Top 0.254: C23.2 4.15,36.99 3.18,36.02 3.18,33.87 | 3.27,33.77 3.18,33.87 | 3.18,33.87 3.18,33.82 3.25,33.75
  Top 0.305: 2.62,33.12 2.11,33.12 2.46,32.78 | 2.62,33.12 3.25,33.75 3.27,33.77 | 2.46,32.78 2.46,32.17 2.08,31.8 1.93,31.8 IC6.5 | 2.62,33.12 2.46,32.95 2.46,32.78 | Q1.2 14.63,27.5 14.82,27.5 15.72,26.6 Q1.4 | IC3.18 14.14,20.65 v14.48,20.31 | IC3.63 26.3,20.65 C8.2 | CON1.S3 7.1,70.12 v7.1,70 | 16,29.46 15.5,29.96 | 15.5,30.5 14.61,31.39 IC5.4
  Top 0.813: 15.5,29.96 15.5,30.5
  Top 1.016: C15.2 13.69,28.45 | 13.69,28.45 Q1.2 | C18.2 25.65,29.4 21.25,29.4 C17.2 C11.2 18.09,28.45 17.08,29.46 16,29.46 15.04,29.46 14.03,28.45 13.69,28.45
  Top 1.27: C14.2 R10.1 C10.2 C8.2 | C4.2 38.9,28.15 R7.1 | C2.2 C16.2 C13.2 6.3,21.65 | R19.1 6.3,21.65 | C1.2 6.35,21.6 6.3,21.65
  other vias: 15.8,21.6 18.8,21.5 19.9,17.3 18,17.3 12.2,11.4 18.7,10.2 20.5,10.2 30,2 36,2 42,2 26,2 22,2 18,2 14,2 10,2 6,2 40,70 36,70 32,70 28,70 24,70 20,70 2,66 2,56 2,52 2,48 1.6,18.7 5.9,14.2 14.2,13 43.7,46.6 42.2,32.8 39.7,30.4 42.2,34.8 39.7,32.1 7.9,28.3 4.4,37.2 46,24 13.5,47 13.5,42.5 10,47 9.5,59.5 14.5,59.5 13.5,35 13.5,32 20,35 31.1,12.7 38.3,9 37,10.3 36.6,24.9 37.4,21.9 34.3,19.3 7.7,38.7 8.8,38.7 22.5,13.5 22.5,15
  pour Top (isolate 0.254, rank 2): -9.8,84.2 -5.5,88.5 48.9,88.5 62.7,74.7 62.7,23.2 62.7,1.8 50.4,-10.5 -5.8,-10.5 -8,-8.3 -9.8,-6.5
  pour Bottom (isolate 0.254, rank 2): -16.3,84.1 -7.1,93.3 55.4,93.3 74.3,74.4 74.3,43.6 74.3,3.7 51.5,-19.1 -7.9,-19.1 -8.3,-18.7 -17.4,-9.6 -17.4,51.8 -17.4,83 -16.4,84
GPS_RX  (via drill 0.3)
  Top 0.305: IC3.17 11.75,21.15 v11.7,21.2
  Bottom 0.305: v11.7,21.2 8.6,21.2 6.17,23.63 6.17,39.97 IC4.2
  other vias: 5.59,40.55
GPS_TX  (via drill 0.3)
  Top 0.305: IC3.16 14.84,22.9 v12.84,22.9 | v4.3,40.6 4.25,40.55 IC4.1
  Bottom 0.305: v12.84,22.9 11.3,22.9 10.1,21.7 9,21.7 6.82,23.88 6.82,40.68 6,41.5 5,41.5 4.3,40.8 v4.3,40.6
INT
  Top 0.305: IC3.36 16.54,10.64 13.7,7.8 12.4,7.8 J2.3
LED1
  Top 0.305: IC3.26 11.75,16.65 10.3,18.1 10.3,19.8 10.2,19.9 LED9.A
LED2
  Top 0.305: IC3.27 11.5,16.15 LED8.A
LED3
  Top 0.305: IC3.28 11.2,15.65 10.25,16.6 LED7.A
LED4
  Top 0.305: IC3.29 9.6,15.15 LED6.A
M0  (via drill 0.3)
  Top 0.305: v20.89,15.21 20.54,14.86 IC3.44
  Bottom 0.305: v20.89,15.21 20.8,15.3 20.8,22.5 20,23.3 20,30.5 21.44,31.94 IC7.1
M1  (via drill 0.3)
  Top 0.305: v21.5,14.6 21.04,14.14 IC3.45
  Bottom 0.305: v21.5,14.6 21.52,14.6 21.55,14.63 21.55,22.66 20.9,23.31 20.9,29.4 21.5,30 24,30 24.95,30.95 IC7.2
MISO  (via drill 0.3)
  Top 0.305: IC3.22 11.05,18.65 v11,18.7 | IC5.2 6.17,33.94 v5.5,33.2
  Bottom 0.305: v5.5,33.2 4.8,32.57 4.8,23.3 9.41,18.68 10.98,18.68 v11,18.7
MOSI  (via drill 0.3)
  Top 0.305: IC3.23 14.45,18.15 v14.5,18.2 | v17.61,31.39 IC5.5
  Bottom 0.305: v14.5,18.2 16.6,20.3 16.6,23.3 17.6,24.3 v17.6,31.39 v17.61,31.39
N$1
  Top 1.016: LED6.C LED7.C LED8.C LED9.C 5.2,19.9 4.35,20.75 R19.2
N$2
  Top 0.508: LED3.C 45.65,35.6 R4.2
N$3
  Top 0.305: U1.7 45.1,27.9 44.7,28.3 44.7,33.05 R4.1
N$4
  Top 0.305: R2.1 44.6,21.05 U1.3
N$5
  Top 0.305: R2.2 42.05,20.2 40.8,18.95 40.77,18.95 40.59,18.78 40.59,18.75 LED2.C
N$6
  Top 0.305: R1.1 46.76,19.41 46.76,20.84 46.3,21.3 45.4,21.3 45.1,21.6 U1.4
N$7
  Top 0.305: R1.2 41.55,18.1 LED1.C
N$8
  Top 0.305: U1.6 45.6,29.75 R3.2
N$9
  Top 0.508: IC2.5 44.71,52.26 45.65,53.2 C12.1 R6.2
N$10
  Top 0.305: Q3.5 43.73,41.12 46.76,44.16 46.76,48.1 45.76,49.1 IC2.3
N$11
  Top 0.305: IC2.1 43.7,49.1 42.7,48.1 42.7,46.3 43.73,45.27 Q3.4
N$12
  Top 0.508: R12.2 45.75,47.4 45.75,47.48 44.7,48.52 IC2.2
N$13
  Top 0.305: R13.1 R14.2 40.35,8.4 Q4.1 33.51,15.24 33.42,15.24 32,16.67 Q5.3
N$14
  Top 0.305: 38.45,3 R13.2 38.45,3.49 38.7,3.25 | 38.45,3 C19.1 | 38.45,3 38.7,3.25 | 38.7,3.25 41.33,3.25 43.68,5.6 44.17,5.6 JP1.2
N$16
  Top 0.305: JP1.1 43.43,8.42 R16.2 35.7,15.95 Q5.1
N$21
  Top 1.27: R10.2 30.7,24.25 31.1,24.65 LED4.C
N$24
  Top 0.203: IC1.5 38,27.28 37.66,27.63 37.52,27.63 R7.2
  Top 0.305: R7.2 35.8,28.2 R8.1
N$25
  Top 0.254: IC1.6 35.59,26.94 R5.1
N$26
  Top 0.305: IC1.2 38,24 39.9,22.1 L1.1
  pour Top (no thermals): 37.8,25.2 37.8,23 38.8,22 39.8,22 39.8,24 39.7,24.1 39.2,24.1 38.1,25.2
N$33
  Top 0.305: IC3.30 11.65,14.65 10.7,13.7 7.55,13.7 C20.1
N$34
  Top 0.305: IC3.3 21.54,24.44 22.6,25.5 25.75,25.5 C18.1 25.8,26.45 Q2.2
N$35
  Top 0.305: IC3.4 21.04,24.46 20.3,25.2 C17.1 21.25,27.5 Q2.1
N$36
  Top 0.305: IC3.6 20.04,24.06 19,25.1 13.25,25.1 C15.1 11.85,26.6 Q1.3
N$38
  Top 0.305: R15.2 26.8,19.15 IC3.60
N$39  (via drill 0.3)
  Top 0.305: v12.14,23.6 12.75,24.2 16.32,24.2 16.54,23.98 IC3.13
  Bottom 0.305: v12.14,23.6 8.2,23.6 FB1.2
  other vias: 8,23.8
N$46
  Top 0.305: Q1.1 16.55,28.2 C11.1 18.3,26.55 20.54,24.31 IC3.5
N$49
  Top 0.406: Q6.3 14.25,61.5 14.05,61.71 14.04,61.71 LED5.C
N$50
  Top 0.406: LED5.A 11.25,60.7 R18.1
NRST  (via drill 0.3)
  Top 0.305: IC3.7 19.54,19.44 v19.5,19.4
  Bottom 0.305: v19.5,19.4 19,18.9 19,16.1 15.2,12.3 9.27,12.3 4.87,7.9 JP2.2
RESET  (via drill 0.3)
  Top 0.305: IC3.33 15.04,13.24 v15.5,13.7 | v9.78,52.62 9.78,54.32 8.13,55.97 IC4.10
  Bottom 0.305: v9.78,52.62 1.3,44.14 1.3,22.23 9.83,13.7 v15.5,13.7
RX
  Top 0.305: J2.1 15,7.75 17.54,10.29 IC3.38
RX_LORA  (via drill 0.3)
  Top 0.305: v22.3,16 20.75,16 20.04,15.29 IC3.43
  Bottom 0.305: v22.3,16 22.77,16 29.2,22.43 29.2,31.11 IC7.4
SCL
  Top 0.305: IC6.4 3.5,31.05 R11.1 7.39,30.4 10.04,27.75 10.04,25.4 10.99,24.45 10.99,23.11 12.39,21.7 14.02,21.7 17.57,18.15 IC3.58
SDA
  Top 0.254: IC6.3 3.67,32.47 4.15,32.95 R9.1
  Top 0.305: IC3.59 17.72,18.65 14.21,22.16 12.59,22.16 11.45,23.3 11.45,24.74 10.54,25.64 10.54,28.02 7.2,31.37 5.4,31.37 4.3,32.47 | 4.3,32.47 IC6.3 | 4.15,32.95 4.15,32.62 4.3,32.47
SYS_JTCK_SWCLK  (via drill 0.3)
  Top 0.305: v24.5,12.9 v24.49,12.91 IC3.49
  Bottom 0.305: J1.1 34.7,6.4 32.6,8.5 28.9,8.5 v24.5,12.9
SYS_JTMS_SWDIO
  Top 0.305: IC3.46 21.54,10.76 21.9,10.4 29,10.4 J1.2
TIMER  (via drill 0.3)
  Top 0.305: IC3.35 16.04,12.64 16.8,13.4 16.8,14.9 16.2,15.5 v15.5,15.5 | v11.79,52.61 15.23,56.05 IC4.7
  Bottom 0.305: v11.79,52.61 2.7,43.52 2.7,22.75 9.95,15.5 v15.5,15.5
TX
  Top 0.305: J2.2 17.04,10.44 IC3.37
TX_LORA  (via drill 0.3)
  Top 0.305: IC3.42 19.54,15.79 20.61,16.86 v22.3,16.86
  Bottom 0.305: v22.3,16.86 28.3,22.86 28.3,31.13 IC7.3
V+  (via drill 0.3, 0.4 pad 1)
  Top 0.203: v42,26.25 43.1,26.25 U1.10 43.6,29 C9.1
  Top 0.305: R14.1 38.45,7.35 Q4.3
  Top 0.406: C4.1 v42,26.25
  Top 0.813: R6.1 40.9,52.85 40.9,44.6 | 43.6,29 40.9,31.7 40.9,41.6 | 40.9,44.6 40.9,43.6 | 40.9,43.6 40.9,42.6 | 40.9,42.6 40.9,41.6 | 40.9,42.6 v41.9,42.6 | v41.9,43.6 40.9,43.6 | v41.9,43.6 40.9,44.6 | v41.9,42.6 40.9,41.6 | v41.9,42.6 41.6,42.9 41.6,43.3 v41.9,43.6
  Bottom 0.406: v42,26.25 42,21.28 33.52,12.8 Q4.3
  Bottom 0.813: v41.9,42.6 43,43.7 V+.1 43.9,43.3 41.6,43.3 v41.9,43.6
  other vias: 33,12.8
  pour Top (no thermals): 42.8,29.3 42.8,27.8 41.9,26.9 41.9,25.7 43.9,25.7 44.2,26 44.2,29.3
  pour Top (no thermals): 38.6,25.1 39.9,25.1 40.4,25.6 40.4,26.5 39.7,25.8 38.6,25.8
V-  (via drill 0.4 pad 1)
  Top 0.508: 44.7,44 44.92,44.23 44.92,45.08 Q3.2 Q3.3 44.48,45.08 44.48,44.23 44.7,44
  Top 0.813: C12.2 43.65,53.4 43.65,51.8 IC2.6 43.65,51.6 43.65,51 42.96,50.31 42.41,50.31 42.05,49.95 v42.05,49.85 | v42.05,49.85 41.94,49.74 41.94,45.14 43.24,43.84 44.54,43.84 44.7,44 | v42.05,49.85 v42.05,48.71 v42.06,48.7
  Bottom 0.813: v42.06,48.7 V-.1
  Bottom 1.27: SJ1.1 V-.1

### Text on the board
tNames: DESIGNED BY: / WIKTOR TASAREK / ŁUKASZ KOZAK | GPS FIX | If You can read this / 1. Your Warranty is void / 2. Telemetry probably doesn't work | JLCJLCJLCJLC | It's Rocket Science | PUT RocketLab | GPS Tracker v2.0 | C:/Users/lukas/OneDrive - Związek Miast Polskich/Dokumenty/RocketLab/ed-pcb-design-putrocketlab/02_HEXA_2/07_GPS_tracker/BMP/ICONS.bmp
bNames: GND<>V-